# Altium schematic sheet I2C-SPI_Communication.SchDoc
size A4
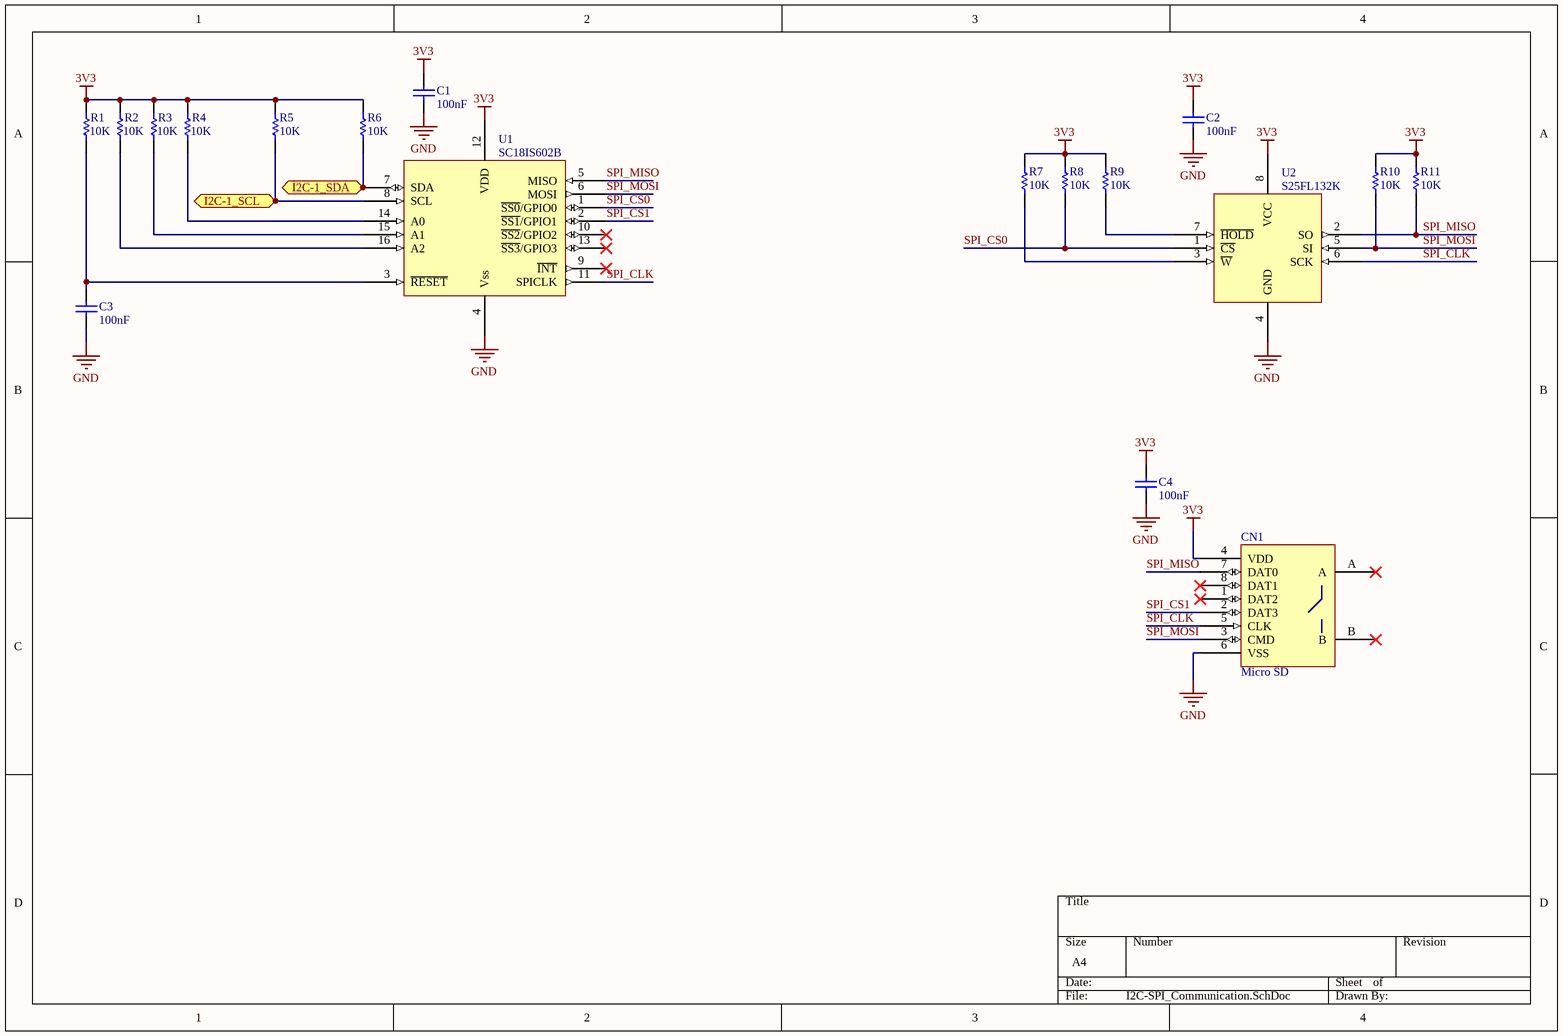
[diagram p0: I2C-SPI_Communication.SchDoc]

## Parts
C1  100nF  [CC1005-0402]
C2  100nF  [CC1005-0402]
C3  100nF  [CC1005-0402]
C4  100nF  [CC1005-0402]
CN1  Micro SD  [MICROSD]
R1  value 10K  [AXIAL-0.3]  (hidden comment: Res1)
R2  value 10K  [AXIAL-0.3]  (hidden comment: Res1)
R3  value 10K  [AXIAL-0.3]  (hidden comment: Res1)
R4  value 10K  [AXIAL-0.3]  (hidden comment: Res1)
R5  10K  [CR1005-0402_NP]
R6  10K  [CR1005-0402_NP]
R7  10K  [CR1005-0402]
R8  10K  [CR1005-0402]
R9  10K  [CR1005-0402]
R10  10K  [CR1005-0402]
R11  10K  [CR1005-0402]
U1  SC18IS602B  [TSSOP-16N]
U2  S25FL132K  [SOIC-8N]

## Ports
I2C-1_SCL (in), I2C-1_SDA (bidir)

## Nets
3V3: C1.2 C2.2 C4.2 CN1.4(VDD) R1.2 R2.2 R3.2 R4.2 R5.2 R6.2 R7.2 R8.2 R9.2 R10.2 R11.2 U1.12(VDD) U2.8(VCC)
GND: C1.1 C2.1 C3.1 C4.1 CN1.6(VSS) U1.4(Vss) U2.4(GND)
I2C-1_SCL: R5.1 U1.8(SCL) ; port I2C-1_SCL
I2C-1_SDA: R6.1 U1.7(SDA) ; port I2C-1_SDA
SPI_CLK: CN1.5(CLK) U1.11(SPICLK) U2.6(SCK)
SPI_CS0: R8.1 U1.1(~{SS0}/GPIO0) U2.1(~{CS})
SPI_CS1: CN1.2(DAT3) U1.2(~{SS1}/GPIO1)
SPI_MISO: CN1.7(DAT0) R11.1 U1.5(MISO) U2.2(SO)
SPI_MOSI: CN1.3(CMD) R10.1 U1.6(MOSI) U2.5(SI)
NetC3_2: C3.2 R1.1 U1.3(~{RESET})
NetR2_1: R2.1 U1.16(A2)
NetR3_1: R3.1 U1.15(A1)
NetR4_1: R4.1 U1.14(A0)
NetR7_1: R7.1 U2.3(~{W})
NetR9_1: R9.1 U2.7(~{HOLD})

Not connected (* = marked no-connect by the designer): CN1 1(DAT2)* 8(DAT1)* A* B*; U1 9(~{INT})* 10(~{SS2}/GPIO2)* 13(~{SS3}/GPIO3)*

## Library data of the parts
C1 C2 C4 = Capacitor: CAP CER 0.1UF 16V 10% X7R 0402; eVendor Part#: 490-3261-1-ND; Manufacturer: Murata Electronics North America; Part#: GRM155R71C104KA88D; eVendor: Digikey; eVendor Price: 0,1; MSRP: 0,00375; MOQ: 1000; NP: NP
C3 = Capacitor: eVendor: *; eVendor Price: *; eVendor Part#: *; Manufacturer: *; Part#: *; MOQ: *; MSRP: *; NP: NP
CN1 = Micro SD: CONN MICRO SD R/A PUSH-PULL SMD; eVendor Part#: HR1941CT-ND; Manufacturer: Hirose Electric Co Ltd; Part#: DM3D-SF; eVendor: Digikey; eVendor Price: 1,92; MSRP: 0,7847; MOQ: 1000; NP: NP
R1-R4 = Res1: Resistor; Published: 8-Jun-2000; LatestRevisionDate: 17-Jul-2002; LatestRevisionNote: Re-released for DXP Platform.; PackageReference: AXIAL-0.3; Publisher: Altium Limited; PackageDescription: Axial Device, Thru-Hole; 2 Leads; 0.3 in Pin Spacing
R5 R6 = Resistor: eVendor: *; eVendor Price: *; Manufacturer: *; MSRP: *; MOQ: *; Part#: *; NP: NP
R7-R11 = Resistor: RES SMD 10K OHM 1% 1/10W 0402; eVendor Part#: P10.0KLCT-ND; Manufacturer: Panasonic Electronic Components; Part#: ERJ-2RKF1002X; eVendor: Digikey; eVendor Price: 0,1; MSRP: 0,00544; MOQ: 1000; NP: NP
U1 = SC18IS602B: IC BRIDGE I2C/SPI 16-TSSOP; eVendorPart#: 568-10300-1-ND; Manufacturer: NXP USA Inc; Part#: SC18IS602BIPW,128; eVendor: Digikey; eVendorPrice: 2,73; MSRP: 2,00850; MOQ: 100
U2 = S25FL132K: Flash 32Mb, 3V, 108Mhz CMOS SPI Flash; Manufacturer: Spansion; eVendor Part#: 797-25FL132K0XMFI041; Part#: S25FL132K0XMFI041; eVendor: Mouser; eVendor Price: 0,58; MSRP: 0,44; MOQ: 1000; NP: NP